# EAGLE design harp timestamp generator gen1 (EAGLE 9.5.1)
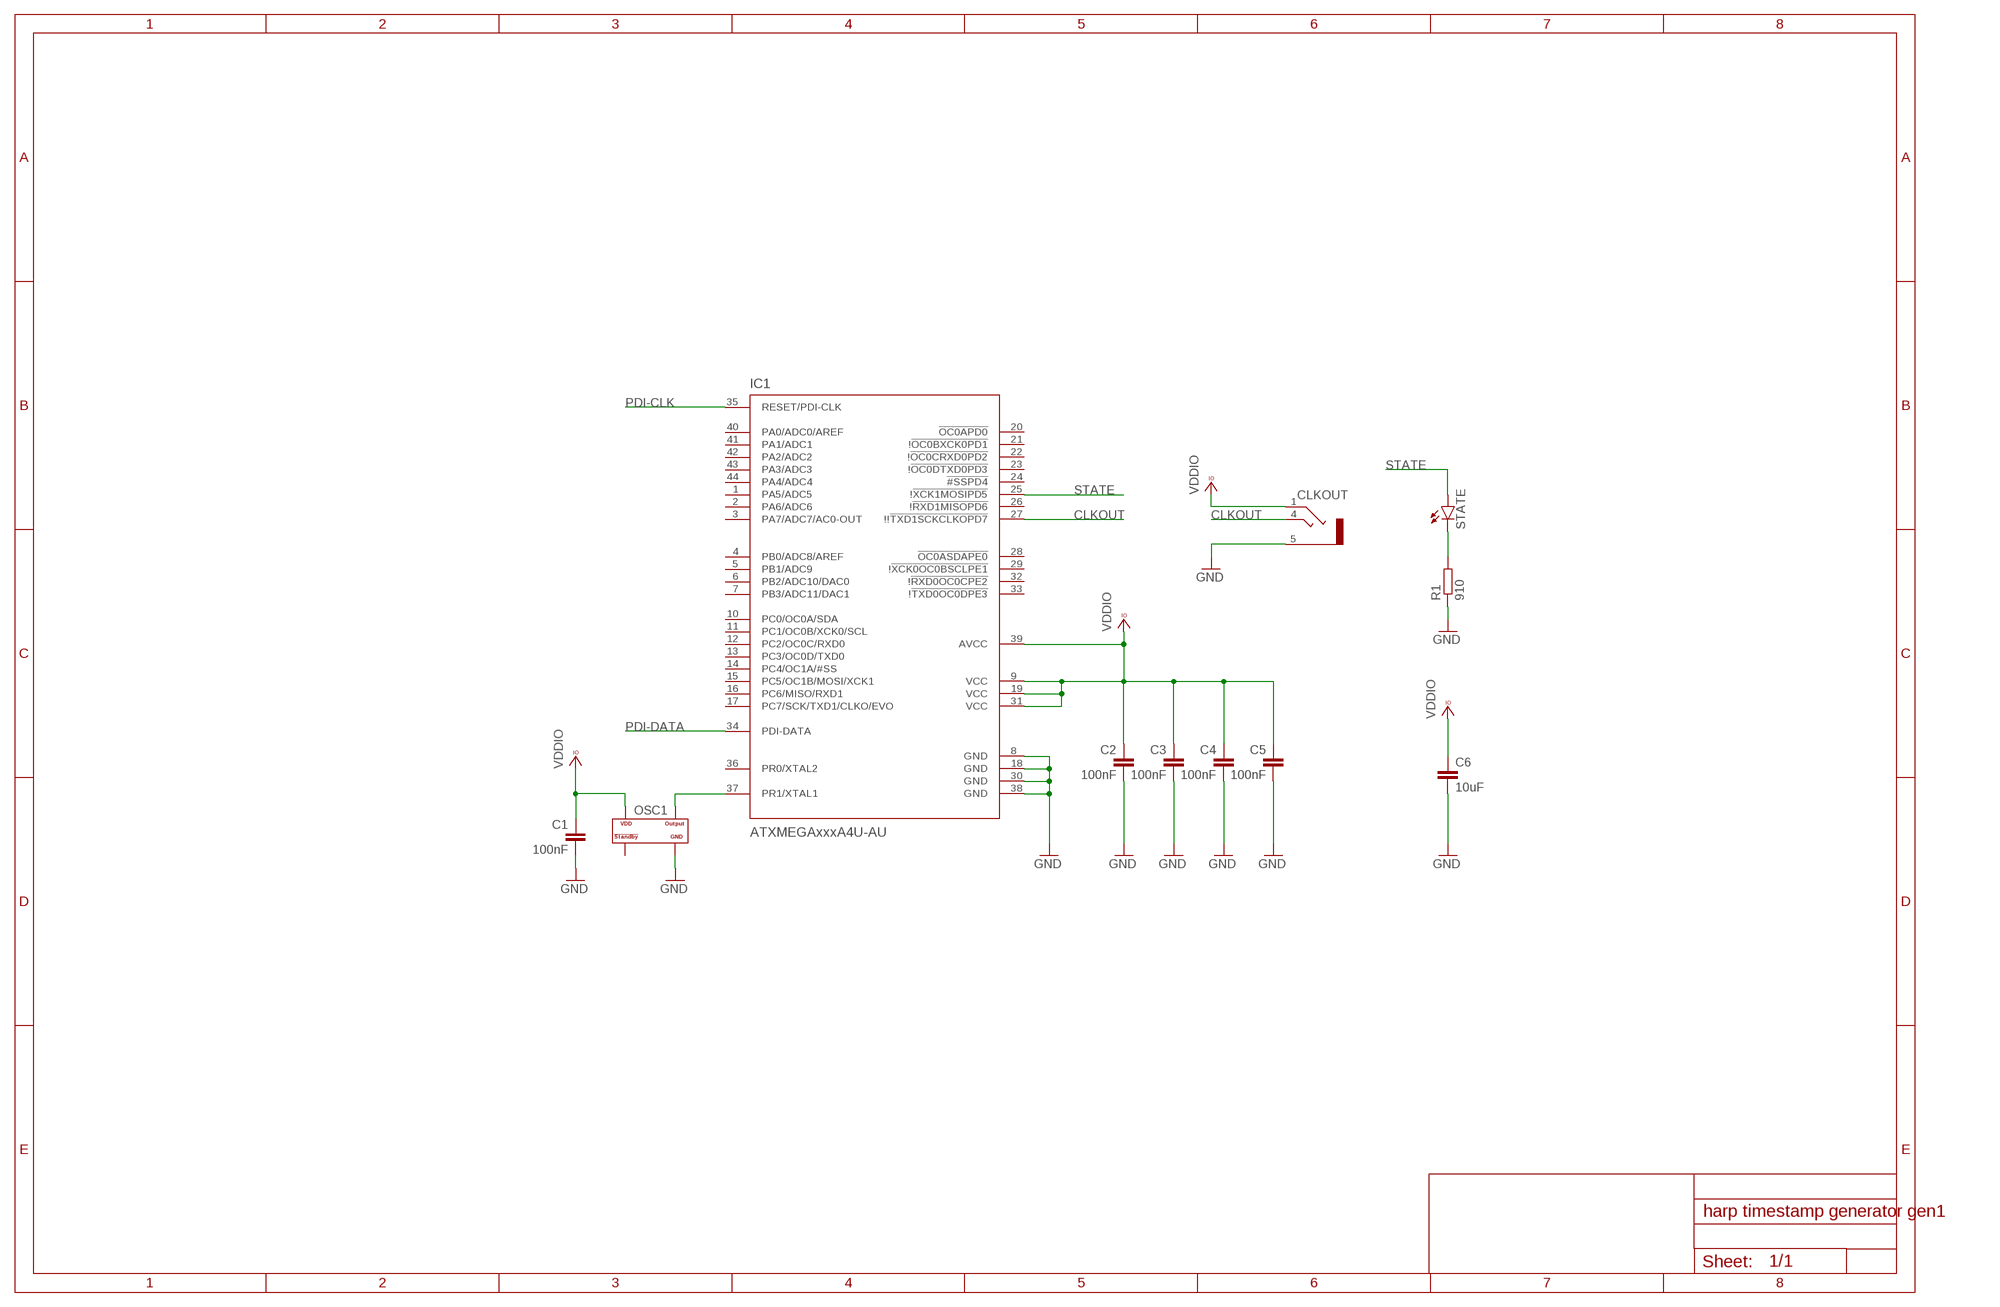
[diagram p0: schematic, sheet 1]

## Parts
C1  100nF  C-EUC0402  [C0402]
C2  100nF  C-EUC0402  [C0402]
C3  100nF  C-EUC0402  [C0402]
C4  100nF  C-EUC0402  [C0402]
C5  100nF  C-EUC0402  [C0402]
C6  10uF  C-EUC0603  [C0603]
CLKOUT  STEREO_JACK  [35RASMT2BHNTRX]
IC1  ATXMEGAxxxA4U-AU  AT-XMEGA-XXA4-AU  [QFP80P1200X1200X120-44N]
OSC1  CNP-MISCELLANEOUS_OSCILLATOR  [CNP-MISCELLANEOUS_OSCILLATOR_3.2X2.5]
R1  910  R-EU_R0402  [R0402]
STATE  LEDCHIP-LED0603  [CHIP-LED0603]

## Nets
CLKOUT: CLKOUT.4 IC1.27(!!!TXD1SCKCLKOPD7)
GND: C1.2 C2.2 C3.2 C4.2 C5.2 C6.2 CLKOUT.5 IC1.8(GND) IC1.18(GND) IC1.30(GND) IC1.38(GND) OSC1.P$2(GND) R1.1
N$1: R1.2 STATE.C
OSC1: IC1.37(PR1/XTAL1) OSC1.P$3(OUTPUT)
PDI-CLK: IC1.35(RESET/PDI-CLK)
PDI-DATA: IC1.34(PDI-DATA)
STATE: IC1.25(!!XCK1MOSIPD5) STATE.A
VCCIO: C1.1 C2.1 C3.1 C4.1 C5.1 C6.1 CLKOUT.1 IC1.9(VCC) IC1.19(VCC) IC1.31(VCC) IC1.39(AVCC) OSC1.P$4(VDD) ; supply symbol labelled VDDIO
Unconnected: IC1.1(PA5/ADC5) IC1.2(PA6/ADC6) IC1.3(PA7/ADC7/AC0-OUT) IC1.4(PB0/ADC8/AREF) IC1.5(PB1/ADC9) IC1.6(PB2/ADC10/DAC0) IC1.7(PB3/ADC11/DAC1) IC1.10(PC0/OC0A/SDA) IC1.11(PC1/OC0B/XCK0/SCL) IC1.12(PC2/OC0C/RXD0) IC1.13(PC3/OC0D/TXD0) IC1.14(PC4/OC1A/#SS) IC1.15(PC5/OC1B/MOSI/XCK1) IC1.16(PC6/MISO/RXD1) IC1.17(PC7/SCK/TXD1/CLKO/EVO) IC1.20(!OC0APD0) IC1.21(!!OC0BXCK0PD1) IC1.22(!!OC0CRXD0PD2) IC1.23(!!OC0DTXD0PD3) IC1.24(!#SSPD4) IC1.26(!!RXD1MISOPD6) IC1.28(!OC0ASDAPE0) IC1.29(!!XCK0OC0BSCLPE1) IC1.32(!!RXD0OC0CPE2) IC1.33(!!TXD0OC0DPE3) IC1.36(PR0/XTAL2) IC1.40(PA0/ADC0/AREF) IC1.41(PA1/ADC1) IC1.42(PA2/ADC2) IC1.43(PA3/ADC3) IC1.44(PA4/ADC4) OSC1.P$1(STANDBY#)

## Library data of the parts
C1-C6 = rcl:C-EU: CAPACITOR, European symbol
CLKOUT = CNP-connectors:STEREO_JACK
IC1 = xmega-a4:AT-XMEGA-XXA4-AU: ATxMega a4 Serie
OSC1 = harp rfid reader v1.0:CNP-MISCELLANEOUS_OSCILLATOR
R1 = rcl:R-EU_: RESISTOR, European symbol; SPICEPREFIX: R
STATE = led:LED: LED OSRAM: - CHIPLED LG R971, LG N971, LY N971, LG Q971, LY Q971, LO R971, LY R971 LH N974, LH R974 LS Q976, LO Q976, LY Q976 LO Q996 - Hyper CHIPLED LW Q18S LB Q993, LB Q99A, LB R99A - SideLED LS A670, LO A670, LY A670, LG A670, LP A670 LB A673, LV A673, LT A673, LW A673 LH A674 LY A675 LS A676, LA A676, LO A676, LY A676, LW A676 LS A679, LY A679, LG A679 - Hyper Micro SIDELED® LS Y876, LA Y876, LO Y876, LY Y876 LT Y87S - SmartLED LW L88C, LW L88S LB L89C, LB L89S, LG L890 LS L89K, LO L89K, LY L89K LS L896, LA L896, LO L896, LY L896 - TOPLED LS T670, LO T670, LY T670, LG T670, LP T670 LSG T670, LSP T670, LSY T670, LOP T670, LYG T670 LG T671, LOG T671, LSG T671 LB T673, LV T673, LT T673, LW T673 LH T674 LS T676, LA T676, LO T676, LY T676, LB T676, LH T676, LSB T676, LW T676 LB T67C, LV T67C, LT T67C, LS T67K, LO T67K, LY T67K, LW E67C LS E67B, LA E67B, LO E67B, LY E67B, LB E67C, LV E67C, LT E67C LW T67C LS T679, LY T679, LG T679 LS T770, LO T770, LY T770, LG T770, LP T770 LB T773, LV T773, LT T773, LW T773 LH T774 LS E675, LA E675, LY E675, LS T675 LS T776, LA T776, LO T776, LY T776, LB T776 LHGB T686 LT T68C, LB T68C - Hyper Mini TOPLED® LB M676 - Mini TOPLED Santana® LG M470 LS M47K, LO M47K, LY M47K Source: http://www.osram.convergy.de LUXEON: - LUMILED® LXK2-PW12-R00, LXK2-PW12-S00, LXK2-PW14-U00, LXK2-PW14-V00 LXK2-PM12-R00, LXK2-PM12-S00, LXK2-PM14-U00 LXK2-PE12-Q00, LXK2-PE12-R00, LXK2-PE12-S00, LXK2-PE14-T00, LXK2-PE14-U00 LXK2-PB12-K00, LXK2-PB12-L00, LXK2-PB12-M00, LXK2-PB14-N00, LXK2-PB14-P00, LXK2-PB14-Q00 LXK2-PR12-L00, LXK2-PR12-M00, LXK2-PR14-Q00, LXK2-PR14-R00 LXK2-PD12-Q00, LXK2-PD12-R00, LXK2-PD12-S00 LXK2-PH12-R00, LXK2-PH12-S00 LXK2-PL12-P00, LXK2-PL12-Q00, LXK2-PL12-R00 Source: www.luxeon.com KINGBRIGHT: KA-3528ASYC Source: www.kingbright.com

## Board
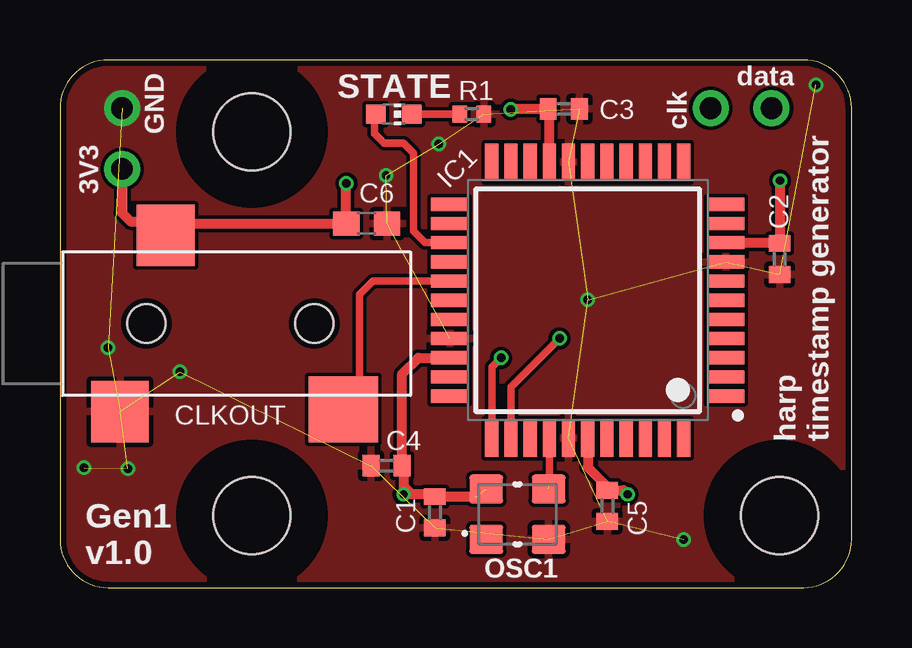
[diagram p1: board, top side]
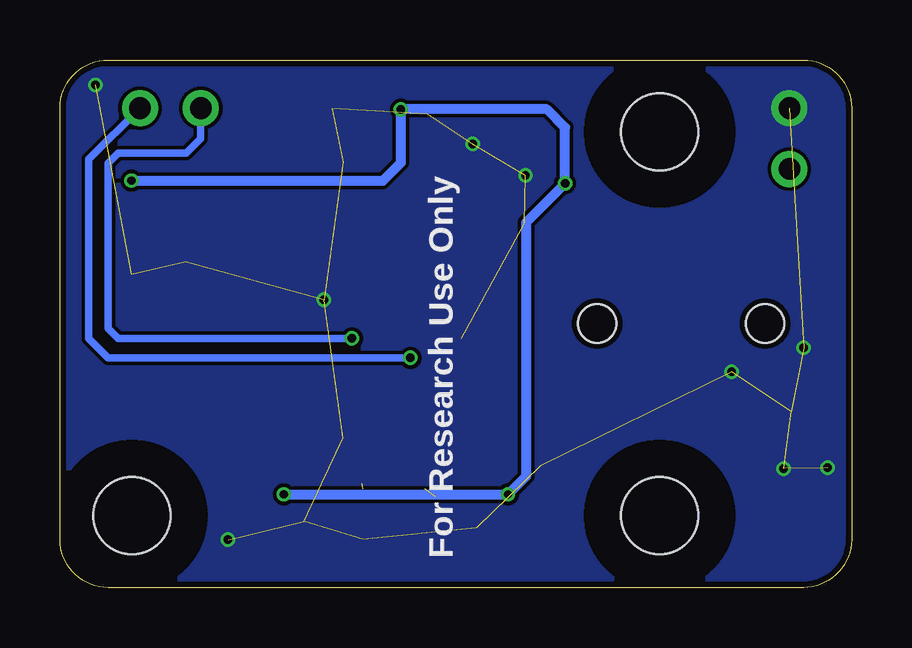
[diagram p2: board, bottom side, seen from below]

Size 33 x 22 mm. Coordinates in mm from the lower left corner, seen from the top.
Outline: 31,0 arc90 33,2 33,20 arc90 31,22 2,22 arc90 0,20 0,2 arc90 2,0 31,0
Copper layers (1*16): Top 0.018mm / dielectric 1.55mm / Bottom 0.018mm
Design rules "eC_2Layer_PClass6_BaseCopperO18_eCDefault *": minimum track width 6mil, minimum drill 0.35mm, track to track 6mil, track to pad 6mil, pad to pad 6mil, via to via 6mil, smd to smd 0mil, copper to edge 0.25mm, drill to drill 0.35mm, minimum pad ring 0.175mm, minimum via ring 0.125mm, stop-mask expansion 0mil, vias tented up to drill 0.45mm, thermal gap 0.2mm
Holes 3.2 mm at 30,3 8,3 8,19
tRestrict: area 5,16 to 11,22; area 5,0 to 11,6; area 27,0 to 33,6
bRestrict: area 5,0 to 11,6; area 5,16 to 11,22; area 27,0 to 33,6

### Footprints (pad centres in the part's own frame; a part is rotated, then mirrored left to right if it is on the bottom)
C0402 = smd 0.7 x 0.9: 1 -0.65,0; 2 0.65,0
C0603 = smd 1.1 x 1: 1 -0.85,0; 2 0.85,0
35RASMT2BHNTRX = smd 2.4 x 2.55: 1 0.8,3.675; 5 -1.1,-3.675 | smd 2.9 x 2.75: 4 8.2,-3.575 | hole 1.6: 0,0; 7,0
QFP80P1200X1200X120-44N = smd 1.55 x 0.55: 1 -5.75,4; 2 -5.75,3.2; 3 -5.75,2.4; 4 -5.75,1.6; 5 -5.75,0.8; 6 -5.75,0; 7 -5.75,-0.8; 8 -5.75,-1.6; 9 -5.75,-2.4; 10 -5.75,-3.2; 11 -5.75,-4; 23 5.75,-4; 24 5.75,-3.2; 25 5.75,-2.4; 26 5.75,-1.6; 27 5.75,-0.8; 28 5.75,0; 29 5.75,0.8; 30 5.75,1.6; 31 5.75,2.4; 32 5.75,3.2; 33 5.75,4 | smd 0.55 x 1.55: 12 -4,-5.75; 13 -3.2,-5.75; 14 -2.4,-5.75; 15 -1.6,-5.75; 16 -0.8,-5.75; 17 0,-5.75; 18 0.8,-5.75; 19 1.6,-5.75; 20 2.4,-5.75; 21 3.2,-5.75; 22 4,-5.75; 34 4,5.75; 35 3.2,5.75; 36 2.4,5.75; 37 1.6,5.75; 38 0.8,5.75; 39 0,5.75; 40 -0.8,5.75; 41 -1.6,5.75; 42 -2.4,5.75; 43 -3.2,5.75; 44 -4,5.75
CNP-MISCELLANEOUS_OSCILLATOR_3.2X2.5 = smd 1.4 x 1.2: P$1 -1.3,-1.05; P$2 1.3,-1.05; P$3 1.3,1.05; P$4 -1.3,1.05
R0402 = smd 0.6 x 0.7: 1 -0.5,0; 2 0.5,0
CHIP-LED0603 = smd 0.8 x 0.8: A 0,-0.75; C 0,0.75

### Placement (x,y rotation side)
C1  15.63,3.14 270 top
C2  30,13.7 270 top
C3  21,19.96 0 top
C4  13.62,5.08 180 top
C5  22.82,3.41 270 top
C6  12.78,15.18 0 top
CLKOUT  3.61,11.01 0 top
IC1  22,11.98 180 top
OSC1  19.07,3.06 0 top
R1  17.17,19.74 180 top
STATE  13.92,19.74 270 top

### Tracks (layer width: path | path; a pad name or v marks a point on that pad's centre or on a via)
CLKOUT
  Top 0.305: IC1.27 13.06,12.78 12.5,12.22 12.5,7.54 12.39,7.43 CLKOUT.4
GND  (via drill 0.35, 0.9 pad 1.5)  (22 unrouted)
  other vias: 2.83,4.96 26,2 31.52,20.96 22,12 5,9 1,5 2,10 13.59,17.19 2.59,19.99 15.79,18.49
  pour Top: 0,0 33,0 33,22 0,22
  pour Bottom: 33,0 0,0 0,22 33,22
N$1
  Top 0.305: STATE.C R1.2
OSC1  (1 unrouted)
  Top 0.305: IC1.37 20.4,4.34
PDI-CLK  (via drill 0.35, 0.9 pad 1.5)
  Top 0.305: IC1.35 18.8,8.36 v20.83,10.39
  Bottom 0.305: v20.83,10.39 30.58,10.39 30.99,10.8 30.99,17.7 30.58,18.11 27.74,18.11 27.13,18.72 v27.13,19.99
PDI-DATA  (via drill 0.35, 0.9 pad 1.5)
  Top 0.305: IC1.34 18,9.19 v18.39,9.58
  Bottom 0.305: v18.39,9.58 30.99,9.58 31.8,10.39 31.8,17.86 v29.67,19.99
STATE
  Top 0.305: IC1.25 15.21,14.38 14.73,14.86 14.73,18.12 14.33,18.52 13.51,18.52 13.11,18.92 13.11,19.67 STATE.A
VCCIO  (via drill 0.35, 0.9 pad 1.5)  (1 unrouted)
  Top 0.305: 14.33,4.29 14.73,3.89 | 4.16,15.27 4.58,14.85
  Top 0.406: CLKOUT.1 4.58,14.85 4.9,15.18 C6.1 v11.93,16.84 v11.95,16.85 | v18.8,19.94 18.82,19.96 C3.1 20.4,19.91 IC1.19 | C2.1 29.97,14.38 | v30.02,16.97 30.02,14.38 29.97,14.38 | v23.67,3.89 23.5,4.06 C5.1 22.82,4.2 22,5.01 IC1.39 | IC1.9 29.97,14.38 | 17.35,3.79 C1.1 15.53,3.89 14.73,3.89 v14.33,3.89 14.33,4.29 14.33,5.02 C4.1 14.27,8.91 14.94,9.58 IC1.31 | v2.59,17.45 2.59,15.62 2.95,15.27 4.16,15.27
  Bottom 0.406: v30.02,16.97 19.53,16.97 18.8,17.7 v18.8,19.94 12.7,19.94 11.95,19.19 v11.95,16.85 13.57,15.23 13.57,4.64 v14.33,3.89 v23.67,3.89

### Text on the board
tPlace: data | GND | clk | 3V3 | harp / timestamp generator | Gen1 / v1.0
bPlace: For Research Use Only